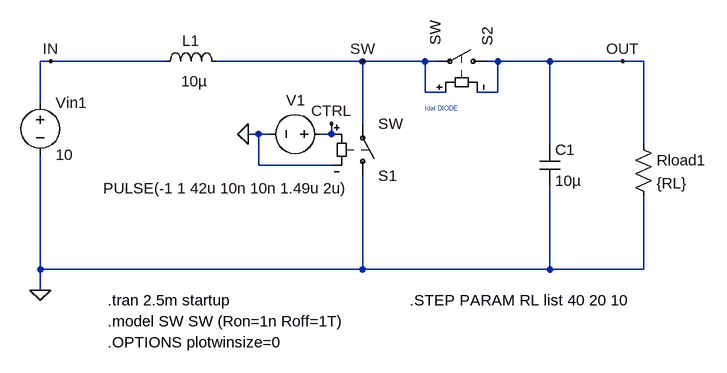
[diagram p0: schematic Fig_7-13_Boost_Ideal_Current_1.asc]
Fig_7-13_Boost_Ideal_Current_1.asc, the LTspice schematic file:
Version 4
SHEET 1 880 680
WIRE -992 -448 -1008 -448
WIRE -816 -448 -992 -448
WIRE -512 -448 -736 -448
WIRE -416 -448 -512 -448
WIRE -400 -448 -416 -448
WIRE -304 -448 -320 -448
WIRE -224 -448 -304 -448
WIRE -112 -448 -224 -448
WIRE -80 -448 -112 -448
WIRE -416 -400 -416 -448
WIRE -384 -400 -416 -400
WIRE -304 -400 -304 -448
WIRE -304 -400 -336 -400
WIRE -1008 -384 -1008 -448
WIRE -512 -352 -512 -448
WIRE -672 -336 -688 -336
WIRE -656 -336 -672 -336
WIRE -560 -336 -560 -352
WIRE -560 -336 -576 -336
WIRE -224 -320 -224 -448
WIRE -80 -320 -80 -448
WIRE -672 -288 -672 -336
WIRE -560 -288 -672 -288
WIRE -1008 -128 -1008 -304
WIRE -512 -128 -512 -272
WIRE -512 -128 -1008 -128
WIRE -224 -128 -224 -256
WIRE -224 -128 -512 -128
WIRE -80 -128 -80 -240
WIRE -80 -128 -224 -128
WIRE -1008 -96 -1008 -128
FLAG -1008 -96 0
FLAG -112 -448 OUT
FLAG -992 -448 IN
FLAG -512 -448 SW
FLAG -560 -352 CTRL
FLAG -688 -336 0
SYMBOL sw -512 -256 M180
SYMATTR InstName S1
SYMBOL ind -832 -432 R270
WINDOW 0 32 56 VTop 2
WINDOW 3 1 61 VBottom 2
SYMATTR InstName L1
SYMATTR Value 10µ
SYMBOL cap -240 -320 R0
SYMATTR InstName C1
SYMATTR Value 10µ
SYMBOL voltage -1008 -400 R0
WINDOW 123 0 0 Left 2
WINDOW 39 0 0 Left 2
SYMATTR InstName Vin1
SYMATTR Value 10
SYMBOL voltage -560 -336 M270
WINDOW 123 0 0 Left 2
WINDOW 39 0 0 Left 2
WINDOW 0 52 40 VRight 2
WINDOW 3 -83 -28 VRight 2
SYMATTR InstName V1
SYMATTR Value PULSE(-1 1 42u 10n 10n 1.49u 2u)
SYMBOL res -96 -336 R0
SYMATTR InstName Rload1
SYMATTR Value {RL}
SYMBOL sw -304 -448 M270
SYMATTR InstName S2
TEXT -904 -48 Left 2 !.model SW SW (Ron=1n Roff=1T)
TEXT -904 -80 Left 2 !.tran 2.5m startup
TEXT -440 -80 Left 2 !.STEP PARAM RL list 40 20 10
TEXT -416 -376 Left 0 ;Idal DIODE
TEXT -904 -16 Left 2 !.OPTIONS plotwinsize=0

The netlist it stands for:
* Fig_7-13_Boost_Ideal_Current_1.asc
S1 0 SW CTRL 0 SW
L1 IN SW 10µ
C1 OUT 0 10µ
Vin1 IN 0 10
V1 CTRL 0 PULSE(-1 1 42u 10n 10n 1.49u 2u)
Rload1 OUT 0 {RL}
S2 OUT SW SW OUT SW
.model SW SW (Ron=1n Roff=1T)
.tran 2.5m startup
.STEP PARAM RL list 40 20 10
* Idal DIODE
.OPTIONS plotwinsize=0
.backanno
.end